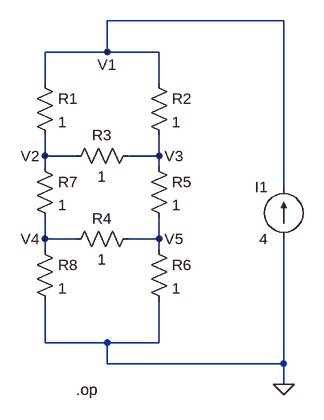
[diagram p0: schematic g3_p9.asc]
g3_p9.asc, the LTspice schematic file:
Version 4
SHEET 1 880 680
WIRE 432 -32 160 -32
WIRE 160 16 160 -32
WIRE 160 16 64 16
WIRE 240 16 160 16
WIRE 64 64 64 16
WIRE 240 64 240 16
WIRE 64 176 64 144
WIRE 112 176 64 176
WIRE 240 176 240 144
WIRE 240 176 192 176
WIRE 64 192 64 176
WIRE 240 192 240 176
WIRE 432 224 432 -32
WIRE 64 304 64 272
WIRE 112 304 64 304
WIRE 240 304 240 272
WIRE 240 304 192 304
WIRE 64 320 64 304
WIRE 240 320 240 304
WIRE 64 464 64 400
WIRE 160 464 64 464
WIRE 240 464 240 400
WIRE 240 464 160 464
WIRE 160 496 160 464
WIRE 432 496 432 304
WIRE 432 496 160 496
WIRE 432 528 432 496
FLAG 432 528 0
FLAG 160 16 V1
FLAG 64 176 V2
FLAG 240 176 V3
FLAG 64 304 V4
FLAG 240 304 V5
SYMBOL res 48 48 R0
SYMATTR InstName R1
SYMATTR Value 1
SYMBOL res 224 48 R0
SYMATTR InstName R2
SYMATTR Value 1
SYMBOL res 48 176 R0
SYMATTR InstName R7
SYMATTR Value 1
SYMBOL res 224 176 R0
SYMATTR InstName R5
SYMATTR Value 1
SYMBOL res 48 304 R0
SYMATTR InstName R8
SYMATTR Value 1
SYMBOL res 224 304 R0
SYMATTR InstName R6
SYMATTR Value 1
SYMBOL res 208 160 R90
WINDOW 0 0 56 VBottom 2
WINDOW 3 32 56 VTop 2
SYMATTR InstName R3
SYMATTR Value 1
SYMBOL res 208 288 R90
WINDOW 0 0 56 VBottom 2
WINDOW 3 32 56 VTop 2
SYMATTR InstName R4
SYMATTR Value 1
SYMBOL current 432 304 R180
WINDOW 0 24 80 Left 2
WINDOW 3 24 0 Left 2
WINDOW 123 0 0 Left 0
WINDOW 39 0 0 Left 0
SYMATTR InstName I1
SYMATTR Value 4
TEXT 112 536 Left 2 !.op

The netlist it stands for:
* g3_p9.asc
R1 V1 V2 1
R2 V1 V3 1
R7 V2 V4 1
R5 V3 V5 1
R8 V4 0 1
R6 V5 0 1
R3 V3 V2 1
R4 V5 V4 1
I1 0 V1 4
.op
.backanno
.end